# Altium schematic sheet sch.SchDoc
size A3; SheetNumber: 1; SheetTotal: 1
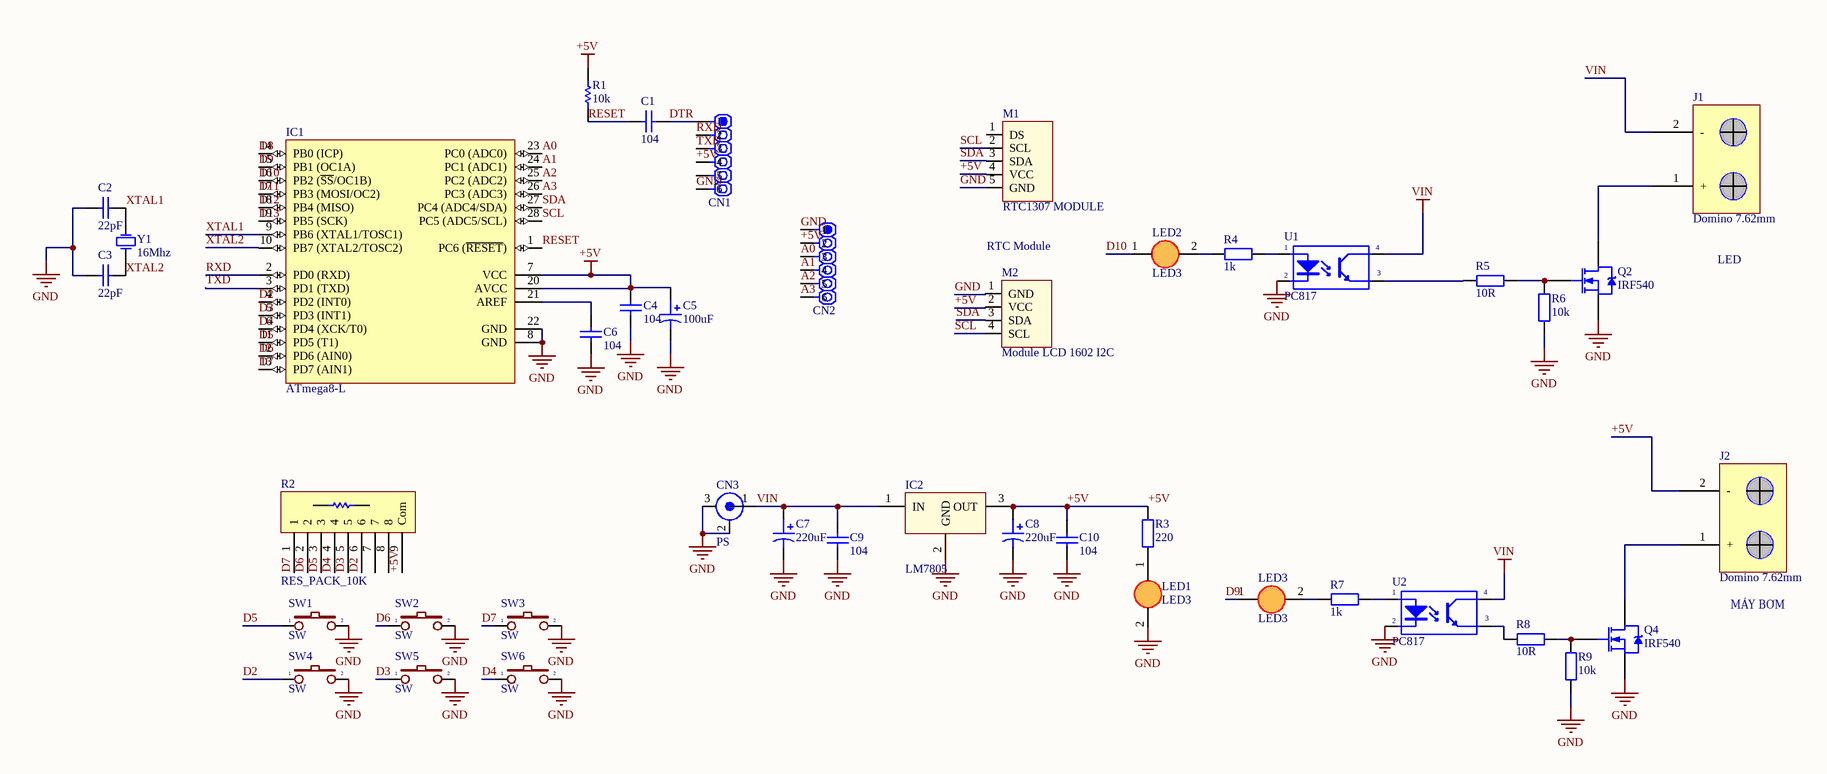
[diagram p0: sch.SchDoc]

## Parts
C1  value 104  [C-NP-0805]  (hidden comment: Cap Non-pol)
C2  value 22pF  [C-NP-0805]  (hidden comment: Cap Non-pol)
C3  value 22pF  [C-NP-0805]  (hidden comment: Cap Non-pol)
C4  value 104  [C-NP-0805]  (hidden comment: Cap Non-pol)
C5  value 100uF  [RADIAL D]  (hidden comment: Cap Pol)
C6  value 104  [C-NP-0805]  (hidden comment: Cap Non-pol)
C7  value 220uF  [RADIAL E]  (hidden comment: Cap Pol)
C8  value 220uF  [RADIAL E]  (hidden comment: Cap Pol)
C9  value 104  [Cap Non-Pol 3mm]  (hidden comment: Cap Non-pol)
C10  value 104  [Cap Non-Pol 3mm]  (hidden comment: Cap Non-pol)
CN1  IO  [CON.HDR1X6]  (value not drawn)
CN2  IO  [CON.HDR1X6]  (value not drawn)
CN3  PS  [JACK DC]
IC1  ATmega8-L  [DIP28/W0.3]
IC2  LM7805  [QTO-220]
J1  Domino 7.62mm  [KF7.62]
J2  Domino 7.62mm  [KF7.62]
LED1  LED3  [LED3mm]
LED2  LED3  [LED3mm]
LED3  LED3  [LED3mm]
M1  RTC1307 MODULE  [RTCmODULE]
M2  Module LCD 1602 I2C  [LCD1602_I2C]
Q2  IRF540  [TO-220-3]
Q4  IRF540  [TO-220-3]
R1  value 10k  [R-0805]  (hidden comment: RESISTOR)
R2  RES_PACK_10K  [Res Array]
R3  220  [R1/4W]
R4  1k  [R1/4W]
R5  10R  [R1/4W]
R6  10k  [R1/4W]
R7  1k  [R1/4W]
R8  10R  [R1/4W]
R9  10k  [R1/4W]
SW1  SW  [SW2]
SW2  SW  [SW2]
SW3  SW  [SW2]
SW4  SW  [SW2]
SW5  SW  [SW2]
SW6  SW  [SW2]
U1  PC817  [DIP4/W0.3]
U2  PC817  [DIP4/W0.3]
Y1  16Mhz  [XTAL]

## Nets
+5V: C4.2 C5.1 C8.1 C10.1 CN1.4 CN2.2 IC1.7(VCC) IC1.20(AVCC) IC2.3(OUT) J2.2(-) M1.4(VCC) M2.2(VCC) R1.2 R2.9(Com) R3.2
GND: C2.1 C3.1 C4.1 C5.2 C6.1 C7.2 C8.2 C9.2 C10.2 CN1.6 CN2.1 CN3.2(SHIELD) CN3.3(SHIELD) IC1.8(GND) IC1.22(GND) IC2.2(GND) LED1.2(K) M1.5(GND) M2.1(GND) Q2.3(S) Q4.3(S) R6.1 R9.1 SW1.2 SW2.2 SW3.2 SW4.2 SW5.2 SW6.2 U1.2(K) U2.2(K)
VIN: C7.1 C9.1 CN3.1(CENTER) IC2.1(IN) J1.2(-) U1.4(C) U2.4(C)
A0: CN2.3 IC1.23(PC0_(ADC0))
A1: CN2.4 IC1.24(PC1_(ADC1))
A2: CN2.5 IC1.25(PC2_(ADC2))
A3: CN2.6 IC1.26(PC3_(ADC3))
D2: IC1.4(PD2_(INT0)) R2.6 SW4.1
D3: IC1.5(PD3_(INT1)) R2.5 SW5.1
D4: IC1.6(PD4_(XCK/T0)) R2.4 SW6.1
D5: IC1.11(PD5_(T1)) R2.3 SW1.1
D6: IC1.12(PD6_(AIN0)) R2.2 SW2.1
D7: IC1.13(PD7_(AIN1)) R2.1 SW3.1
D8: IC1.14(PB0_(ICP))
D9: IC1.15(PB1_(OC1A)) LED3.1(A)
D10: IC1.16(PB2_(~{SS}/OC1B)) LED2.1(A)
D11: IC1.17(PB3_(MOSI/OC2))
D12: IC1.18(PB4_(MISO))
D13: IC1.19(PB5_(SCK))
DTR: C1.1 CN1.1
RESET: C1.2 IC1.1(PC6_(~{RESET})) R1.1
RXD: CN1.2 IC1.2(PD0_(RXD))
SCL: IC1.28(PC5_(ADC5/SCL)) M1.2(SCL) M2.4(SCL)
SDA: IC1.27(PC4_(ADC4/SDA)) M1.3(SDA) M2.3(SDA)
TXD: CN1.3 IC1.3(PD1_(TXD))
XTAL1: C2.2 IC1.9(PB6_(XTAL1/TOSC1)) Y1.2(OSC2)
XTAL2: C3.2 IC1.10(PB7_(XTAL2/TOSC2)) Y1.1(OSC1)
NetC6_2: C6.2 IC1.21(AREF)
NetJ1_1: J1.1(+) Q2.2(D)
NetJ2_1: J2.1(+) Q4.2(D)
NetLED1_1: LED1.1(A) R3.1
NetLED2_2: LED2.2(K) R4.2
NetLED3_2: LED3.2(K) R7.2
NetQ2_1: Q2.1(G) R5.2 R6.2
NetQ4_1: Q4.1(G) R8.2 R9.2
NetR4_1: R4.1 U1.1(A)
NetR5_1: R5.1 U1.3(E)
NetR7_1: R7.1 U2.1(A)
NetR8_1: R8.1 U2.3(E)

Not connected (* = marked no-connect by the designer): CN1 5; M1 1(DS); R2 7 8

## Notes on the sheet
- RTC Module
- LED
- MÁY BƠM

## Library data of the parts
C1-C4 C6 C9 C10 = Cap Non-pol: Non-polarized Capacitor; Published: 8-Jun-2000; LatestRevisionDate: 17-Jul-2002; LatestRevisionNote: Re-released for DXP Platform.; PackageReference: RAD-0.3; Publisher: Altium Limited
C5 C7 C8 = Cap Pol: Polarized Capacitor; Published: 8-Jun-2000; LatestRevisionDate: 17-Jul-2002; LatestRevisionNote: Re-released for DXP Platform.; PackageReference: POLAR0.8; Publisher: Altium Limited
CN1 CN2 = CON.HDR1x6: Header 1x6; Publisher: Hoang Nguyen; ComponentLink1Description: Digikey Part link; ComponentLink2Description: Open DataSheet; ComponentLink2URL: H:\LIBRARY\LIBRARY.Datasheet\
CN3 = CON.DCjack: DC Power Jack, 2.5mm, KLD Series, PCB Mount; Vendor: Nhat Tao; ComponentLink1Description: Digikey Part link; ComponentLink2Description: Open DataSheet; ComponentLink2URL: H:\LIBRARY\LIBRARY.Datasheet\; Price: 1.500VND
IC1 = ATmega8-L: 8-Bit AVR Microcontroller with 8K Bytes of In-System Programmable Flash Memory; Value: ATmega8-L
IC2 = LM78xx_1: On ap +, from + 5 to + 24VDC; Value: LM7805
J1 J2 = Con2-7.62mm
LED1-LED3 = LED 3mm
M1 = RTC1307_MODULE
M2 = LCD1602_I2C
Q2 Q4 = IRF540: HEXFET N-Channel Power MOSFET; Note: Pin 2 is electrically connected to pin 4.; Published: 8-Jun-2000; LatestRevisionDate: 17-Jul-2002; LatestRevisionNote: Re-released for DXP Platform.; DatasheetVersion: PD-9.373H; PackageVersion: Feb-1997; PackageReference: TO-220AB; Publisher: Altium Limited; PackageDescription: TO, Thru-Hole, Vertical, Heatsink Mounted; 3 In-Line Leads; Pitch 2.54 mm; ComponentLink1Description: Manufacturer Link; ComponentLink1URL: http://www.irf.com/
R2 = RES_PACK_8R: Isolated Resistor Network; Published: 24-Mar-1999; LatestRevisionDate: 17-Jul-2002; LatestRevisionNote: Re-released for DXP Platform.; PackageReference: SSOP16; Publisher: Altium Limited; Code_JEDEC: MO-150-AC
R3-R9 = R1/4W: Resistor 1/4W; Value: R1/4W - 1K
SW1-SW6 = SW2: Switch button 2 pin; Value: SW chip 2 pin
U1 U2 = PC817_1: Single Opto; Value: PC817
Y1 = XTAL: Crystal Oscillator; Published: 8-Jun-2000; LatestRevisionDate: 17-Jul-2002; LatestRevisionNote: Re-released for DXP Platform.; PackageReference: R38; Publisher: Altium Limited
R1 = RESISTOR: Published: 8-Jun-2000; LatestRevisionDate: 17-Jul-2002; LatestRevisionNote: Re-released for DXP Platform.; PackageReference: AXIAL-0.3; Publisher: Altium Limited